# Altium schematic sheet WPT_PLL_Transmitter.SchDoc
size A4; SheetNumber: 3; SheetTotal: 3
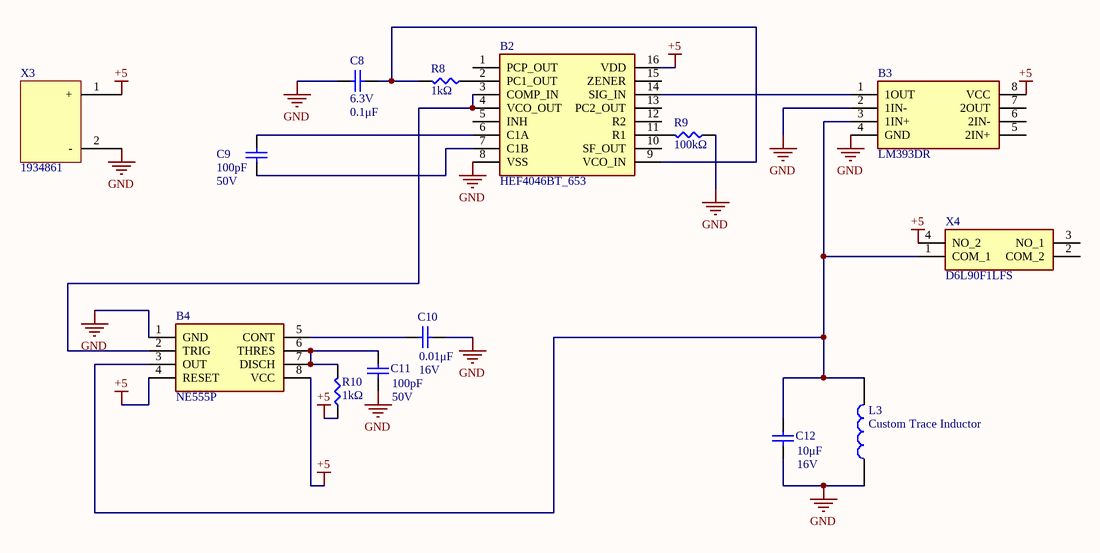
[diagram p0: WPT_PLL_Transmitter.SchDoc]

## Parts
B2  HEF4046BT_653  [HEF4046BT653]
B3  LM393DR  [SOIC127P600X175-8N]
B4  NE555P  [DIP794W53P254L959H508Q8N]
C8  value 0.1μF  Voltage Rating: 6.3V  [CAP0201]  (hidden comment: CL03A104KQ3NNNC)
C9  value 100pF  Voltage Rating: 50V  [CAP0201]  (hidden comment: GCM0335C1H101FA16D)
C10  value 0.01μF  Voltage Rating: 16V  [CAP0402]  (hidden comment: KGM05AR71C103KH)
C11  value 100pF  Voltage Rating: 50V  [CAP0201]  (hidden comment: GCM0335C1H101FA16D)
C12  value 10μF  Voltage Rating: 16V  [CAP0805]  (hidden comment: CL21A106KOCLRNC)
L3  Custom Trace Inductor  [Custom Trace Inductor]
R8  value 1kΩ  [RES1206]  (hidden comment: RNCP1206FTD1K00)
R9  value 100kΩ  [RES0603]  (hidden comment: RC0603FR-07100KL)
R10  value 1kΩ  [RES1206]  (hidden comment: RNCP1206FTD1K00)
X3  1934861  [1934861]
X4  D6L90F1LFS  [D6L90F1LFS]

## Nets
+5: B2.16(VDD) B3.8(VCC) B4.4(RESET) B4.8(VCC) R10.2 X3.1(+) X4.4(NO_2)
GND: B2.8(VSS) B3.2(1IN-) B3.4(GND) B4.1(GND) C8.1 C10.2 C11.2 C12.1 L3.1 R9.2 X3.2(-)
NetB2_2: B2.2(PC1_OUT) R8.2
NetB2_3: B2.3(COMP_IN) B2.4(VCO_OUT) B4.2(TRIG)
NetB2_6: B2.6(C1A) C9.2
NetB2_7: B2.7(C1B) C9.1
NetB2_9: B2.9(VCO_IN) C8.2 R8.1
NetB2_11: B2.11(R1) R9.1
NetB2_14: B2.14(SIG_IN) B3.1(1OUT)
NetB3_3: B3.3(1IN+) B4.3(OUT) C12.2 L3.2 X4.1(COM_1)
NetB4_5: B4.5(CONT) C10.1
NetB4_6: B4.6(THRES) B4.7(DISCH) C11.1 R10.1

Not connected (* = marked no-connect by the designer): B2 1(PCP_OUT) 5(INH) 10(SF_OUT) 12(R2) 13(PC2_OUT) 15(ZENER); B3 5(2IN+) 6(2IN-) 7(2OUT); X4 2(COM_2) 3(NO_1)

## Library data of the parts
B2 = HEF4046BT_653: HEF4046B - Phase-locked loop@en-us; Manufacturer_Name: Nexperia; Manufacturer_Part_Number: HEF4046BT,653; Geometry.Height: 1.75mm; Mouser Part Number: 771-HEF4046BTD-T; Mouser Price/Stock: https://www.mouser.co.uk/ProductDetail/Nexperia/HEF4046BT653?qs=me8TqzrmIYX2aTqHtDTTaw%3D%3D; Datasheet Link: https://assets.nexperia.com/documents/data-sheet/HEF4046B.pdf
B3 = LM393DR: LM393DR, Dual Comparator Open Collector 1.3us 12 V, 15 V, 18 V, 24 V, 28 V, 3 V, 5 V, 9 V 8-Pin SOIC; Manufacturer_Name: Texas Instruments; Geometry.Height: 1.75mm; Mouser Part Number: 595-LM393DR; Mouser Price/Stock: https://www.mouser.co.uk/ProductDetail/Texas-Instruments/LM393DR?qs=8k%2FZSzWMuCP%2FrtMSX0i7pQ%3D%3D; Manufacturer_Part_Number: LM393DR; Datasheet Link: https://www.ti.com/lit/ds/symlink/lm393.pdf?ts=1593083953253&ref_url=https%253A%252F%252Fwww.ti.com%252Fstore%252Fti%252Fen%252Fp%252Fproduct%252F%253Fp%253DLM393DR
B4 = NE555P_1: Precision timer,NE555P 0.5MHz DIL8 Texas Instruments NE555P, Precision Timer, 4.5  16 V, 8-Pin PDIP; Geometry.Height: 5.08mm; Mouser Part Number: 595-NE555P; Mouser Price/Stock: https://www.mouser.co.uk/ProductDetail/Texas-Instruments/NE555P?qs=rkhjVJ6%2F3EIf4CWgjIKuKQ%3D%3D; Manufacturer_Name: Texas Instruments; Manufacturer_Part_Number: NE555P; Datasheet Link: http://www.ti.com/lit/ds/symlink/ne555.pdf
C8 = CL03A104KQ3NNNC: CAP CER 0.1UF 6.3V X5R 0201; Manufacturer 1: Samsung Electro-Mechanics; Supplier 1: Digi-Key; Manufacturer Part Number 1: CL03A104KQ3NNNC; Supplier Part Number 1: 1276-1013-2-ND
C9 C11 = GCM0335C1H101FA16D: CAP CER 100PF 50V C0G/NP0 0201; Manufacturer 1: Murata; Supplier 1: Digi-Key; Manufacturer Part Number 1: GCM0335C1H101FA16D; Supplier Part Number 1: 490-GCM0335C1H101FA16DTR-ND
C10 = KGM05AR71C103KH: CAP CER 10000PF 16V X7R 0402; Manufacturer 1: KYOCERA AVX; Supplier 1: Digi-Key; Manufacturer Part Number 1: KGM05AR71C103KH; Supplier Part Number 1: 478-KGM05AR71C103KHTR-ND
C12 = CL21A106KOCLRNC: CAP CER 10UF 16V X5R 0805; Manufacturer 1: Samsung Electro-Mechanics; Supplier 1: Digi-Key; Manufacturer Part Number 1: CL21A106KOCLRNC; Supplier Part Number 1: 1276-2399-2-ND
L3 = Custom Trace Inductor: Manufacturer_Name: Bourns; Manufacturer_Part_Number: SRN3015-2R2M; Geometry.Height: 1.5mm; Mouser Part Number: 652-SRN3015-2R2M; Mouser Price/Stock: https://www.mouser.co.uk/ProductDetail/Bourns/SRN3015-2R2M?qs=opBjA1TV9012ipbB8adgog%3D%3D; Datasheet Link: *
R8 R10 = RNCP1206FTD1K00: RES 1K OHM 1% 1/2W 1206 /; Manufacturer 1: Stackpole Electronics Inc; Manufacturer Part Number 1: RNCP1206FTD1K00; Supplier Part Number 1: RNCP1206FTD1K00TR-ND; Supplier 1: Digi-Key; Power Rating: 1/2W
R9 = RC0603FR-07100KL: RES 100K OHM 1% 1/10W 0603; Manufacturer 1: Yageo; Manufacturer Part Number 1: RC0603FR-07100KL; Supplier Part Number 1: 311-100KHRTR-ND; Supplier 1: Digi-Key; Power Rating: 1/10W
X4 = D6L90F1LFS: Pushbutton Switches Key Switch N.O. SPDT 100 mA; Manufacturer_Name: C & K COMPONENTS; Geometry.Height: 12.8mm; Mouser Part Number: 611-D6L90F1LFS; Mouser Price/Stock: https://www.mouser.co.uk/ProductDetail/CK/D6L90F1LFS?qs=sb%252But3Lm4x0dNacvZI6mbQ%3D%3D; Manufacturer_Part_Number: D6L90F1LFS; Datasheet Link: https://componentsearchengine.com/Datasheets/2/D6L90F1LFS.pdf